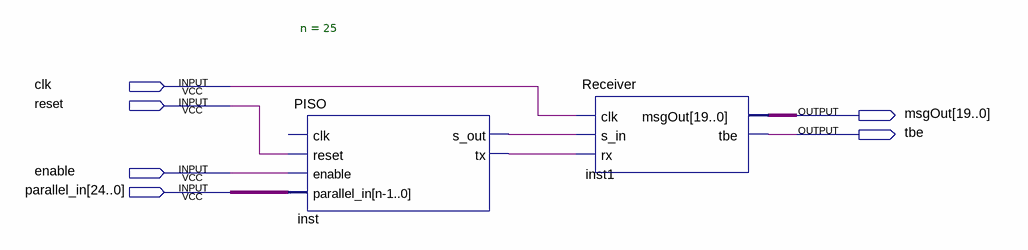
[diagram p0: schematic sheet]
// Quartus schematic Test_Receiver.bdf as structural Verilog: 2 symbols, 6 pins
module Test_Receiver (
  input  clk,
  input  reset,
  input  enable,
  input  [24:0] parallel_in,
  output [19:0] msgOut,
  output tbe
);

  wire inst_s_out, inst_tx;

  PISO #(.n(25)) inst (
    .reset(reset), .enable(enable), .parallel_in(parallel_in), .s_out(inst_s_out), .tx(inst_tx));  // open: clk
  Receiver inst1 (.clk(clk), .s_in(inst_s_out), .rx(inst_tx), .msgOut(msgOut), .tbe(tbe));
endmodule
